# EAGLE design VCA-v2 (EAGLE 6.6.0)

## Sheet 1 of 2: Power
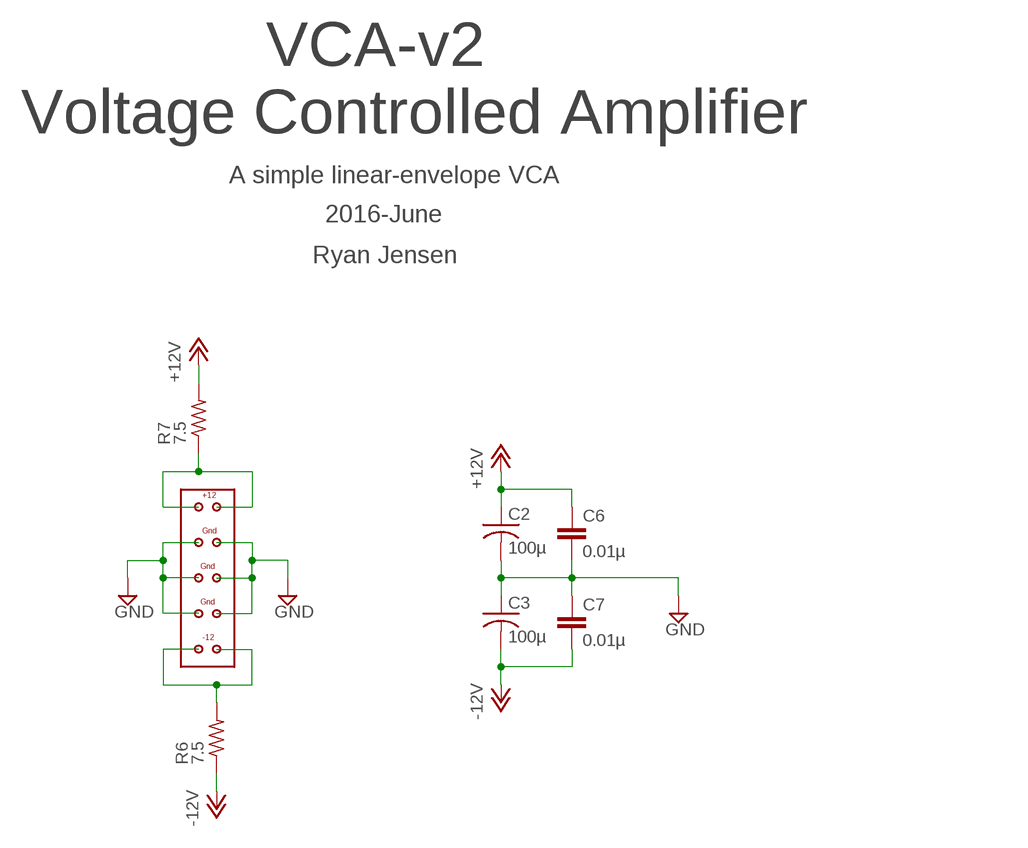
[diagram p0: schematic, sheet 1]

### Parts
C2  100µ  C-US025-050X050  [C025-050X050]
C3  100µ  C-US025-050X050  [C025-050X050]
C6  0.01µ  C2.5/2  [C2.5-2]
C7  0.01µ  C2.5/2  [C2.5-2]
R6  7.5  R-US_R0603  [R0603]
R7  7.5  R-US_R0603  [R0603]
U$1  EURORACK-POWER  [EURORACK-POWER]

### Nets
+12V: C2.1 C6.1 R7.2 ; also sheet 2
-12V: C3.2 C7.2 R6.1 ; also sheet 2
GND: C2.2 C3.1 C6.2 C7.1 U$1.P$3 U$1.P$4 U$1.P$5 U$1.P$6 U$1.P$7 U$1.P$8 ; also sheet 2
N$8: R6.2 U$1.P$9 U$1.P$10
N$10: R7.1 U$1.P$1 U$1.P$2

### Notes on the sheet
- VCA-v2
  Voltage Controlled Amplifier
- A simple linear-envelope VCA
- 2016-June
- Ryan Jensen

## Sheet 2 of 2
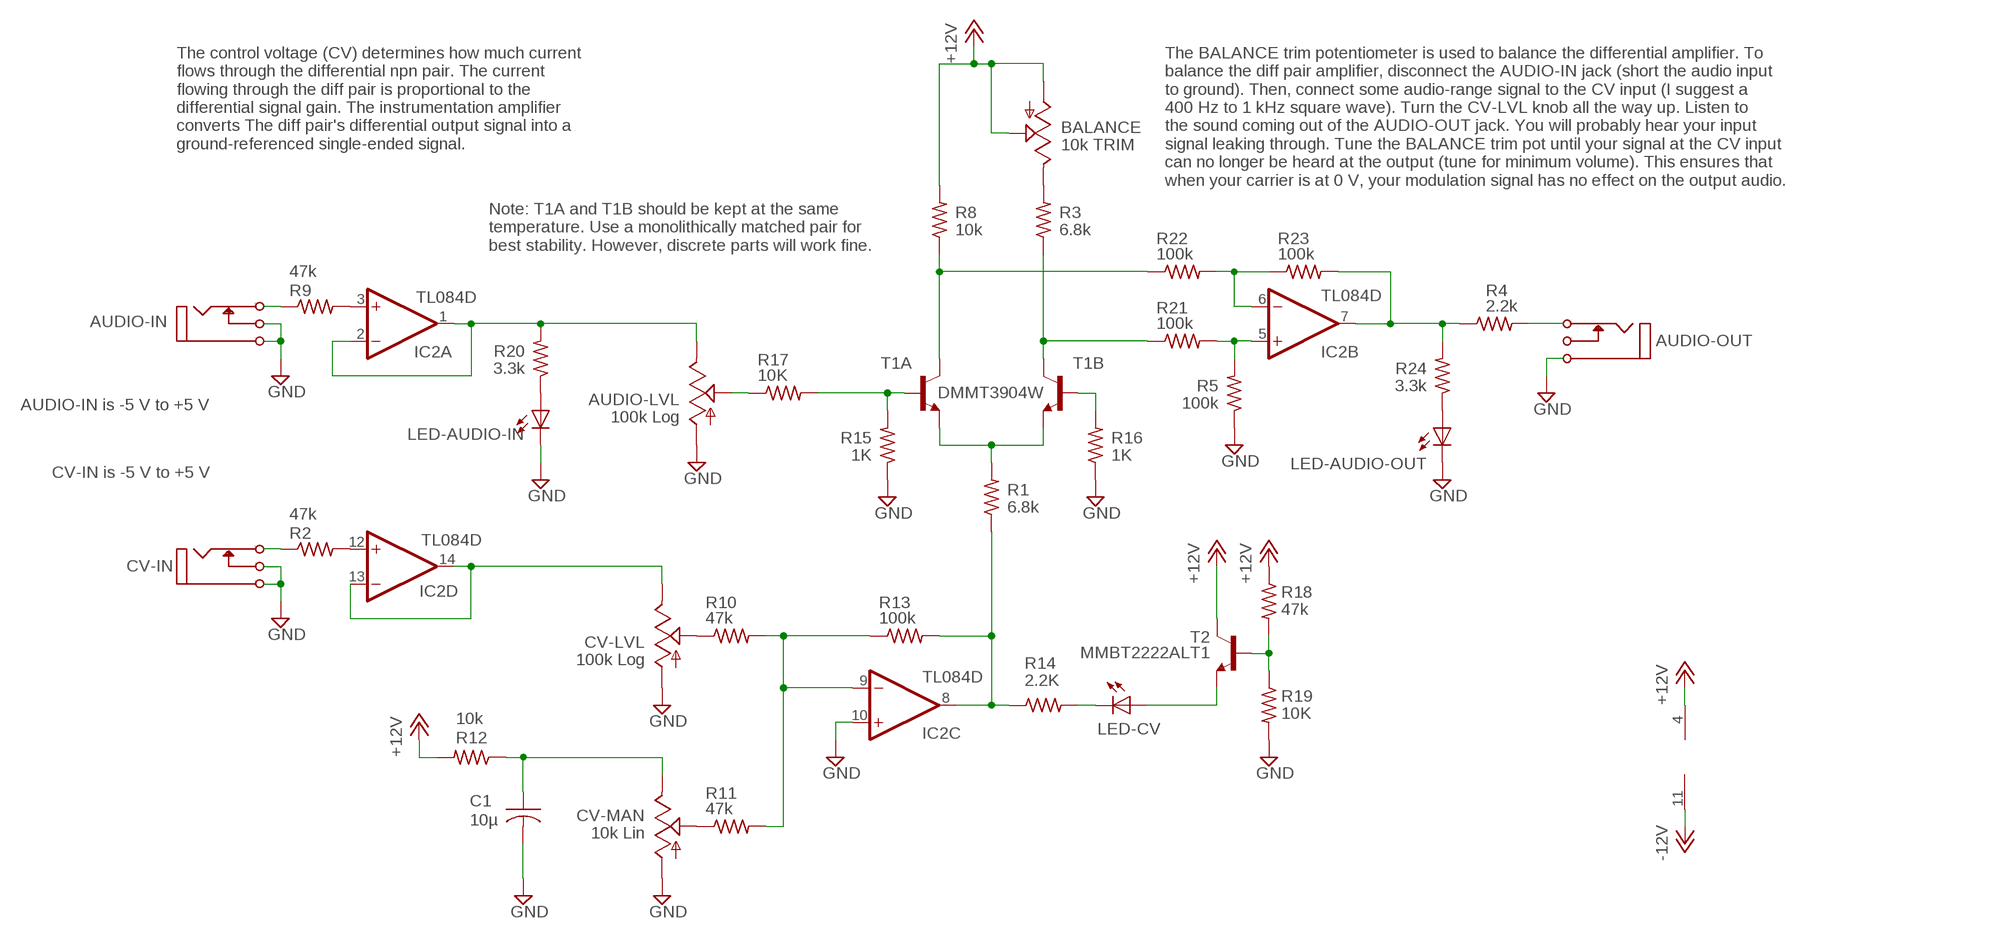
[diagram p1: schematic, sheet 2]

### Parts
AUDIO-IN  I/O  MONO_JACK  [MONO_JACK]
AUDIO-LVL  100k Log  TRIM_US-B64Y  [B64Y]
AUDIO-OUT  I/O  MONO_JACK  [MONO_JACK]
BALANCE  10k TRIM  TRIM_US-B64Y  [B64Y]
C1  10µ  C-US025-050X050  [C025-050X050]
CV-IN  I/O  MONO_JACK  [MONO_JACK]
CV-LVL  100k Log  TRIM_US-B64Y  [B64Y]
CV-MAN  10k Lin  TRIM_US-B64Y  [B64Y]
IC2  TL084D  [SO14]
LED-AUDIO-IN  TLLG4400  [LED3MM]
LED-AUDIO-OUT  TLLG4400  [LED3MM]
LED-CV  TLLG4400  [LED3MM]
R1  6.8k  R-US_R0603  [R0603]
R2  47k  R-US_R0603  [R0603]
R3  6.8k  R-US_R0603  [R0603]
R4  2.2k  R-US_R0603  [R0603]
R5  100k  R-US_R0603  [R0603]
R8  10k  R-US_R0603  [R0603]
R9  47k  R-US_R0603  [R0603]
R10  47k  R-US_R0603  [R0603]
R11  47k  R-US_R0603  [R0603]
R12  10k  R-US_R0603  [R0603]
R13  100k  R-US_R0603  [R0603]
R14  2.2K  R-US_R0603  [R0603]
R15  1K  R-US_R0603  [R0603]
R16  1K  R-US_R0603  [R0603]
R17  10K  R-US_R0603  [R0603]
R18  47k  R-US_R0603  [R0603]
R19  10K  R-US_R0603  [R0603]
R20  3.3k  R-US_R0603  [R0603]
R21  100k  R-US_R0603  [R0603]
R22  100k  R-US_R0603  [R0603]
R23  100k  R-US_R0603  [R0603]
R24  3.3k  R-US_R0603  [R0603]
T1  DMMT3904W  [SOT363]
T2  MMBT2222ALT1  MMBT2222ALT1-NPN-SOT23-BEC  [SOT23-BEC]

### Nets
+12V: BALANCE.A BALANCE.S IC2.4(P:V+) R8.2 R12.2 R18.1 T2.C ; also sheet 1
-12V: IC2.11(P:V-) ; also sheet 1
GND: AUDIO-IN.P$1 AUDIO-IN.P$3(P3) AUDIO-LVL.A AUDIO-OUT.P$1 C1.2 CV-IN.P$1 CV-IN.P$3(P3) CV-LVL.A CV-MAN.A IC2.10(C:+IN) LED-AUDIO-IN.K(C) LED-AUDIO-OUT.K(C) R5.1 R15.1 R16.1 R19.2 ; also sheet 1
LED_SUPPLY: LED-CV.A T2.E
N$1: IC2.8(C:OUT) R1.1 R13.2 R14.1
N$2: BALANCE.E R3.2
N$3: IC2.12(D:+IN) R2.2
N$4: CV-LVL.E IC2.13(D:-IN) IC2.14(D:OUT)
N$5: CV-IN.P$2(P2) R2.1
N$6: AUDIO-IN.P$2(P2) R9.1
N$7: IC2.3(A:+IN) R9.2
N$9: AUDIO-LVL.E IC2.1(A:OUT) IC2.2(A:-IN) R20.2
N$11: CV-LVL.S R10.1
N$12: LED-CV.K(C) R14.2
N$13: CV-MAN.S R11.1
N$14: C1.1 CV-MAN.E R12.1
N$15: R1.2 T1.4(B:E) T1.5(A:E)
N$16: R15.2 R17.2 T1.1(A:B)
N$17: IC2.9(C:-IN) R10.2 R11.2 R13.1
N$18: AUDIO-LVL.S R17.1
N$19: R16.2 T1.2(B:B)
N$20: R18.2 R19.1 T2.B
N$21: LED-AUDIO-IN.A R20.1
N$22: LED-AUDIO-OUT.A R24.1
N$24: R8.1 R22.1 T1.6(A:C)
N$26: R3.1 R21.1 T1.3(B:C)
N$28: IC2.5(B:+IN) R5.2 R21.2
N$30: IC2.6(B:-IN) R22.2 R23.1
N$31: IC2.7(B:OUT) R4.1 R23.2 R24.2
N$32: AUDIO-OUT.P$2(P2) R4.2
Unconnected: AUDIO-OUT.P$3(P3)

### Notes on the sheet
- The control voltage (CV) determines how much current
  flows through the differential npn pair. The current
  flowing through the diff pair is proportional to the
  differential signal gain. The instrumentation amplifier
  converts The diff pair's differential output signal into a
  ground-referenced single-ended signal.
- The BALANCE trim potentiometer is used to balance the differential amplifier. To
  balance the diff pair amplifier, disconnect the AUDIO-IN jack (short the audio input
  to ground). Then, connect some audio-range signal to the CV input (I suggest a
  400 Hz to 1 kHz square wave). Turn the CV-LVL knob all the way up. Listen to
  the sound coming out of the AUDIO-OUT jack. You will probably hear your input
  signal leaking through. Tune the BALANCE trim pot until your signal at the CV input
  can no longer be heard at the output (tune for minimum volume). This ensures that
  when your carrier is at 0 V, your modulation signal has no effect on the output audio.
- Note: T1A and T1B should be kept at the same
  temperature. Use a monolithically matched pair for
  best stability. However, discrete parts will work fine.
- AUDIO-IN is -5 V to +5 V
- CV-IN is -5 V to +5 V

## Library data of the parts
AUDIO-IN AUDIO-OUT CV-IN = !synth_sch:MONO_JACK
AUDIO-LVL BALANCE CV-LVL CV-MAN = pot:TRIM_US-: POTENTIOMETER
C1-C3 = rcl:C-US: CAPACITOR, American symbol
C6 C7 = capacitor-wima:C: CAPACITOR naming: grid - package width
IC2 = linear:TL084: OP AMP
LED-AUDIO-IN LED-AUDIO-OUT LED-CV = led:TLLG4400: Low Current (2mA) LED 3 mm Tinted Diffused Package color GREEN Source: Data sheet <http://www.farnell.com/datasheets/391098.pdf>; MF: VISHAY SEMICONDUCTOR; OC_FARNELL: 1612435
R1-R24 = resistor:R-US_: RESISTOR, American symbol
T1 = !synth_sch:DMMT3904W
T2 = transistor:*-NPN-: NPN Transistror BF959 corrected 2008.03.06
U$1 = !synth_sch:EURORACK-POWER

## Board
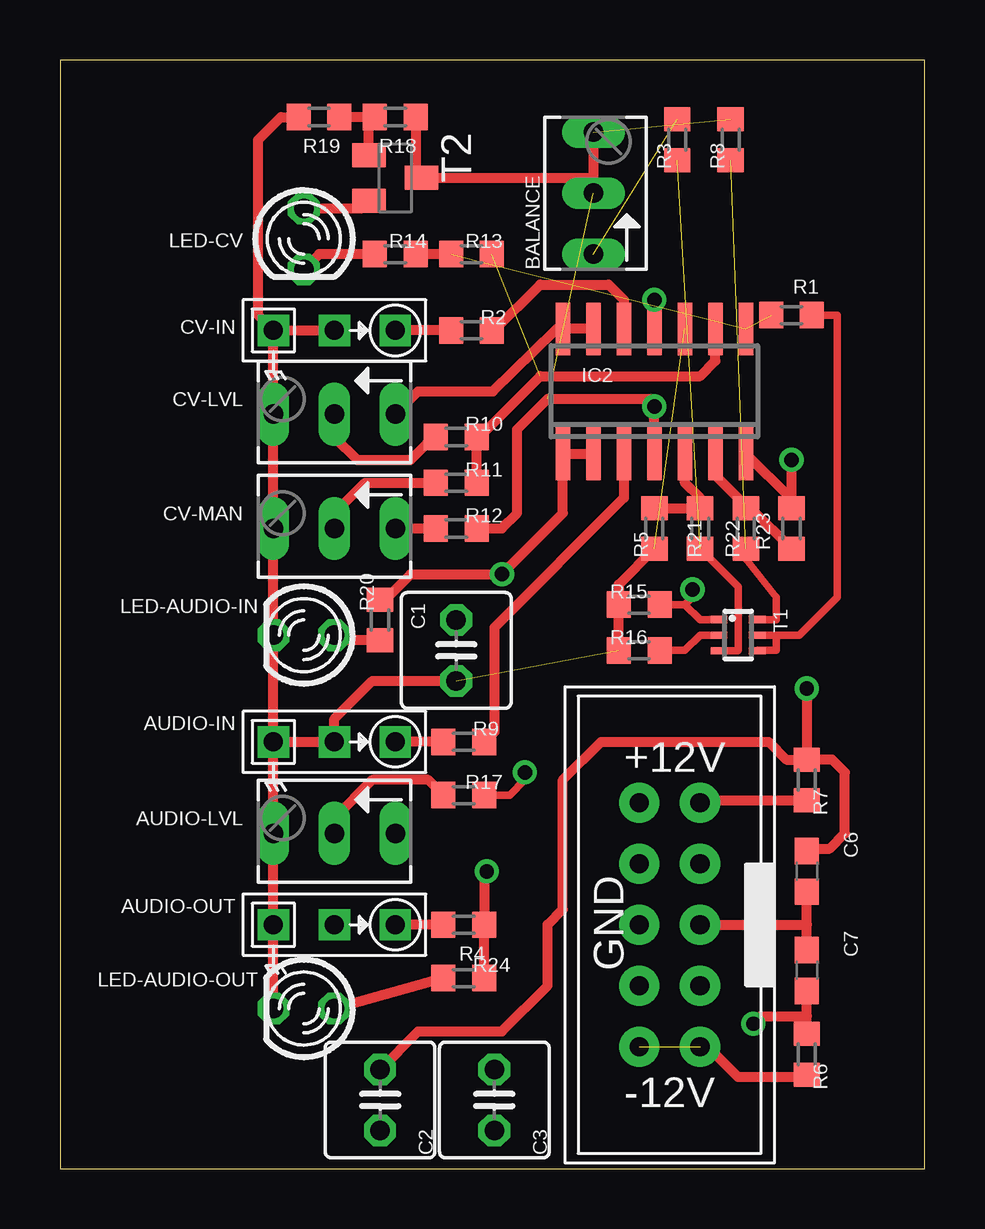
[diagram p2: board, top side]
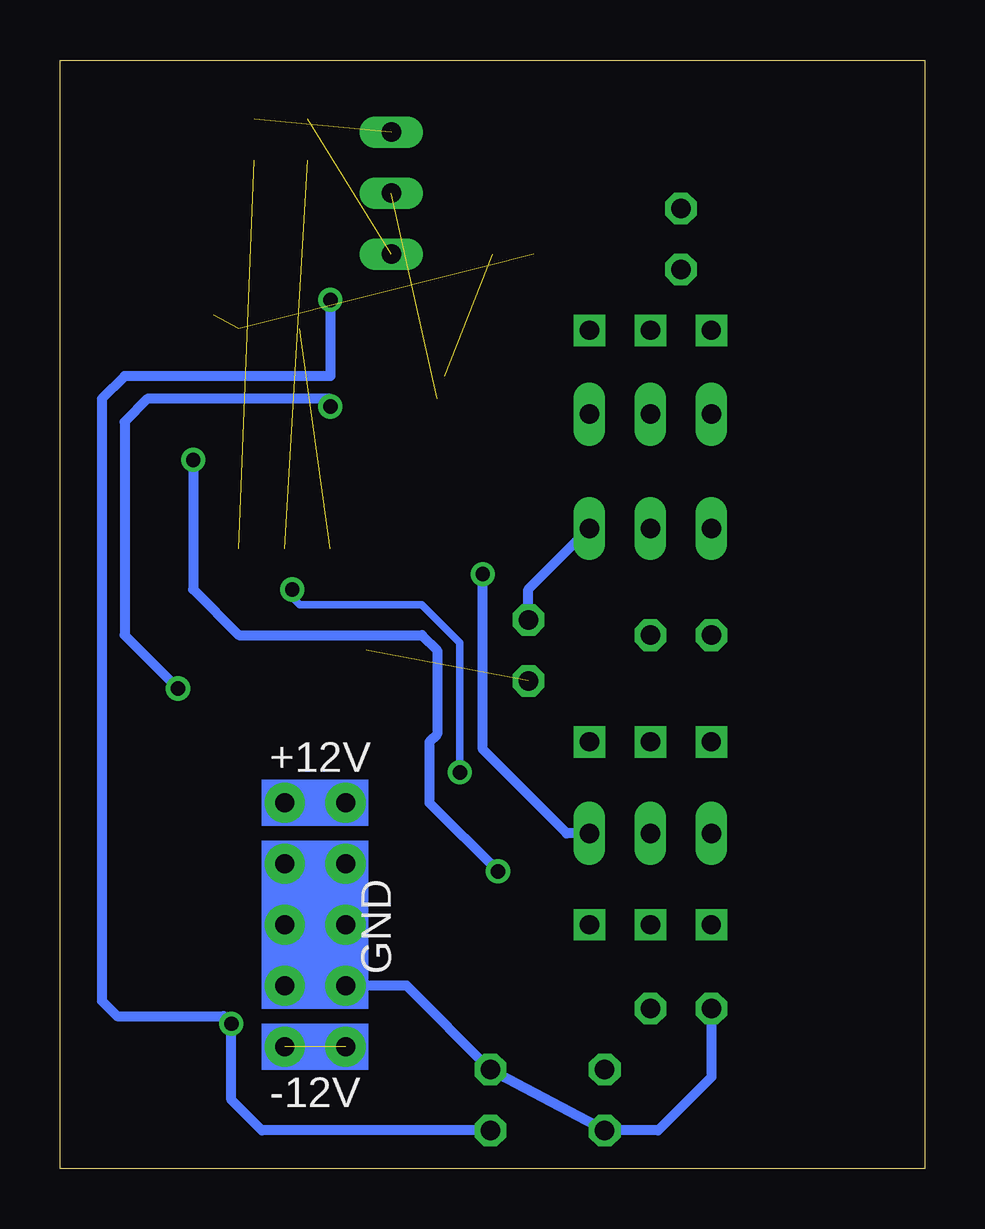
[diagram p3: board, bottom side, seen from below]

Size 36.03 x 46.19 mm. Coordinates in mm from the lower left corner, seen from the top.
Outline: 0,0 36.03,0 36.03,46.19 0,46.19 0,0
Copper layers (1*16): Top 0.035mm / dielectric 1.5mm / Bottom 0.035mm
Design rules "default": minimum track width 10mil, minimum drill 24mil, track to track 8mil, track to pad 8mil, pad to pad 8mil, via to via 8mil, smd to smd 8mil, copper to edge 40mil, drill to drill 8mil, minimum pad ring 10mil, minimum via ring 8mil, stop-mask expansion 4mil, vias tented up to drill 0mil, thermal gap 10mil

### Footprints (pad centres in the part's own frame; a part is rotated, then mirrored left to right if it is on the bottom)
MONO_JACK = drill 0.8 square: P$1 -2.54,0; P$2 2.54,0; P$3 0,0
B64Y = drill 0.813 long: A 2.54,0; E -2.54,0; S 0,0
C025-050X050 = drill 0.813 octagon: 1 -1.27,0; 2 1.27,0
C0603 = smd 1.1 x 1: 1 -0.85,0; 2 0.85,0
SO14 = smd 0.6 x 2.2: 1 -3.81,-2.6; 2 -2.54,-2.6; 3 -1.27,-2.6; 4 0,-2.6; 5 1.27,-2.6; 6 2.54,-2.6; 7 3.81,-2.6; 8 3.81,2.6; 9 2.54,2.6; 10 1.27,2.6; 11 0,2.6; 12 -1.27,2.6; 13 -2.54,2.6; 14 -3.81,2.6
LED3MM = drill 0.813 octagon: A -1.27,0; K 1.27,0
R0603 = smd 1 x 1.1: 1 -0.85,0; 2 0.85,0
SOT363 = smd 0.3 x 0.7: 1 -0.65,-0.8; 2 0,-0.8; 3 0.65,-0.8; 4 0.65,0.8; 5 0,0.8; 6 -0.65,0.8
SOT23-BEC = smd 1 x 1.4: B -0.95,-1.1; C 0,1.1; E 0.95,-1.1
EURORACK-POWER = drill 0.8 pad 1.676: P$1 -1.27,5.08; P$2 1.27,5.08; P$3 -1.27,2.54; P$4 1.27,2.54; P$5 -1.27,0; P$6 1.27,0; P$7 -1.27,-2.54; P$8 1.27,-2.54; P$9 -1.27,-5.08; P$10 1.27,-5.08

### Placement (x,y rotation side)
AUDIO-IN  11.43,17.78 0 top
AUDIO-LVL  11.43,13.97 180 top
AUDIO-OUT  11.43,10.16 0 top
BALANCE  22.23,40.64 90 top
C1  16.51,21.59 270 top
C2  13.34,2.86 270 top
C3  18.1,2.86 270 top
C6  0.01µ  [C0603]  31.11,12.38 270 top
C7  0.01µ  [C0603]  31.11,8.26 270 top
CV-IN  11.43,34.92 0 top
CV-LVL  11.43,31.43 180 top
CV-MAN  11.43,26.67 180 top
IC2  24.77,32.38 0 top
LED-AUDIO-IN  10.16,22.23 180 top
LED-AUDIO-OUT  10.16,6.67 180 top
LED-CV  10.16,38.73 270 top
R1  30.48,35.56 0 top
R2  17.14,34.92 0 top
R3  25.72,42.86 90 top
R4  16.83,10.16 180 top
R5  24.77,26.67 90 top
R6  31.11,4.76 270 top
R7  31.11,16.19 90 top
R8  27.94,42.86 90 top
R9  16.83,17.78 0 top
R10  16.51,30.48 0 top
R11  16.51,28.57 0 top
R12  16.51,26.67 0 top
R13  17.14,38.1 180 top
R14  13.97,38.1 180 top
R15  24.13,23.5 0 top
R16  24.13,21.59 0 top
R17  16.83,15.56 0 top
R18  13.97,43.81 180 top
R19  10.79,43.81 180 top
R20  13.34,22.86 90 top
R21  26.67,26.67 90 top
R22  28.57,26.67 90 top
R23  30.48,26.67 90 top
R24  16.83,7.94 0 top
T1  28.26,22.23 270 top
T2  13.97,41.27 270 top
U$1  25.4,10.16 0 top

### Tracks (layer width: path | path; a pad name or v marks a point on that pad's centre or on a via)
+12V  (via drill 0.6)  (2 unrouted)
  Top 0.406: R18.1 14.82,41.52 T2.C 22.23,41.27 | R12.2 18.41,26.67 19.05,27.3 19.05,30.8 20.32,32.07 24.77,32.07 v24.77,31.75 IC2.4 | BALANCE.A 22.23,41.27 | 22.23,41.27 BALANCE.S | C6.1 31.22,13.34 32.07,13.34 32.7,13.97 32.7,16.51 32.17,17.04 R7.2 | C2.1 14.92,5.71 18.41,5.71 20.32,7.62 20.32,10.16 20.95,10.79 20.95,16.19 22.54,17.78 29.53,17.78 30.27,17.04 R7.2 | v31.11,20 R7.2
  Bottom 0.406: v24.77,31.75 24.77,32.07 32.38,32.07 33.34,31.11 33.34,22.23 v31.11,20
-12V  (via drill 0.6)
  Top 0.406: IC2.11 v24.77,36.2 | R6.1 31.11,6.35 | 31.11,6.35 C7.2 | v28.89,6.03 29.21,6.35 31.11,6.35
  Bottom 0.406: v24.77,36.2 24.77,33.02 33.34,33.02 34.29,32.07 34.29,6.99 33.66,6.35 29.21,6.35 v28.89,6.03 28.89,2.86 27.62,1.59 C3.2
GND  (2 unrouted)
  Top 0.406: LED-AUDIO-OUT.K AUDIO-OUT.P$1 AUDIO-LVL.A AUDIO-IN.P$1 | AUDIO-IN.P$1 AUDIO-IN.P$3 11.43,18.73 13.02,20.32 C1.2 | AUDIO-IN.P$1 LED-AUDIO-IN.K CV-MAN.A CV-LVL.A CV-IN.P$1 | CV-IN.P$1 CV-IN.P$3 | CV-IN.P$1 8.26,35.56 8.26,42.86 9.21,43.81 R19.2 | R16.1 R15.1 23.28,24.34 R5.1 | C7.1 31.11,10.16 | 31.11,10.16 C6.2 | U$1.P$6 31.11,10.16
  Bottom 0.406: U$1.P$4 U$1.P$3 U$1.P$5 U$1.P$6 U$1.P$8 U$1.P$7 21.59,7.62 C3.1 C2.2 11.11,1.59 8.89,3.81 LED-AUDIO-OUT.K
LED_SUPPLY
  Top 0.406: LED-CV.A 12.55,40.01 T2.E
N$1  (2 unrouted)
  Top 0.406: R13.2 R14.1
N$2  (1 unrouted)
N$3
  Top 0.406: R2.2 18.1,34.92 20,36.83 22.86,36.83 23.5,36.2 IC2.12
N$4
  Top 0.406: IC2.13 IC2.14 20.7,34.98 20.64,34.92 18.04,32.38 14.92,32.38 CV-LVL.E
N$5
  Top 0.406: R2.1 CV-IN.P$2
N$6
  Top 0.406: R9.1 AUDIO-IN.P$2
N$7
  Top 0.406: IC2.3 23.5,27.94 18.1,22.54 18.1,18.2 R9.2
N$8  (1 unrouted)
  Top 0.406: R6.2 31.01,3.81 28.26,3.81 26.99,5.08 U$1.P$10
N$9  (via drill 0.6)
  Top 0.406: IC2.2 IC2.1 20.95,27.3 v18.41,24.77 | R20.2 13.55,23.71 14.61,24.77 v18.41,24.77 | v18.41,24.77 18.73,24.77
  Bottom 0.406: AUDIO-LVL.E 14.92,13.97 18.41,17.46 v18.41,24.77
N$10
  Top 0.406: U$1.P$2 26.77,15.34 R7.1
  Bottom 0.406: U$1.P$1 U$1.P$2
N$11
  Top 0.406: CV-LVL.S 11.43,30.48 12.38,29.53 14.61,29.53 15.24,30.16 15.56,30.58 R10.1
N$12
  Top 0.406: R14.2 10.79,38.1 LED-CV.K
N$13
  Top 0.406: CV-MAN.S 11.43,27.3 12.7,28.57 R11.1
N$14
  Top 0.406: CV-MAN.E R12.1
  Bottom 0.406: C1.1 16.51,24.13 CV-MAN.E
N$15
  Top 0.305: T1.4 29.07,21.59 29.84,21.59 29.84,22.23 | T1.5 29.84,22.23 | 29.84,22.23 30.8,22.23 32.38,23.81 32.38,35.56 R1.2
N$16  (via drill 0.6)
  Top 0.305: T1.1 27.44,22.86 26.67,22.86 26.04,23.5 | R15.2 26.04,23.5 | 26.04,23.5 26.35,23.81 v26.35,24.13 | v19.37,16.51 19.37,16.19 18.73,15.56 R17.2
  Bottom 0.305: v26.35,24.13 26.35,23.81 26.04,23.5 20.95,23.5 19.37,21.91 v19.37,16.51
N$17  (1 unrouted)
  Top 0.406: R11.2 R10.2 17.46,30.48 20,33.02 26.67,33.02 27.3,33.66 IC2.9
N$18
  Top 0.406: R17.1 15.34,16.19 13.02,16.19 11.43,14.61 AUDIO-LVL.S
N$19
  Top 0.305: T1.2 26.67,22.23 26.04,21.59 R16.2
N$20
  Top 0.406: T2.B 12.87,43.56 R18.2 R19.1
N$21
  Top 0.406: R20.1 11.64,22.01 LED-AUDIO-IN.A
N$22
  Top 0.406: R24.1 LED-AUDIO-OUT.A
N$24  (1 unrouted)
  Top 0.305: T1.6 29.07,22.86 29.84,22.86 29.84,23.81 28.57,25.4 R22.1
  Top 0.406: R22.1 28.42,25.67
N$26  (1 unrouted)
  Top 0.305: R21.1 28.26,24.23 28.26,21.59 28.24,21.57 T1.3
N$28
  Top 0.406: IC2.5 26.04,28.57 26.67,27.94 R21.2 R5.2
N$30
  Top 0.406: IC2.6 27.3,28.89 28.57,27.62 R22.2 28.78,27.52 R23.1
N$31  (via drill 0.6)
  Top 0.406: IC2.7 30.48,27.88 R23.2 v30.48,29.53 | R24.2 R4.1 17.68,12.28 v17.78,12.38
  Bottom 0.406: v30.48,29.53 30.48,24.13 28.57,22.23 20.95,22.23 20.32,21.59 20.32,18.1 20.64,17.78 20.64,15.24 v17.78,12.38
N$32
  Top 0.406: R4.2 AUDIO-OUT.P$2